# Altium schematic sheet USB.SchDoc: USB TO UART/PROGRAM
size A3
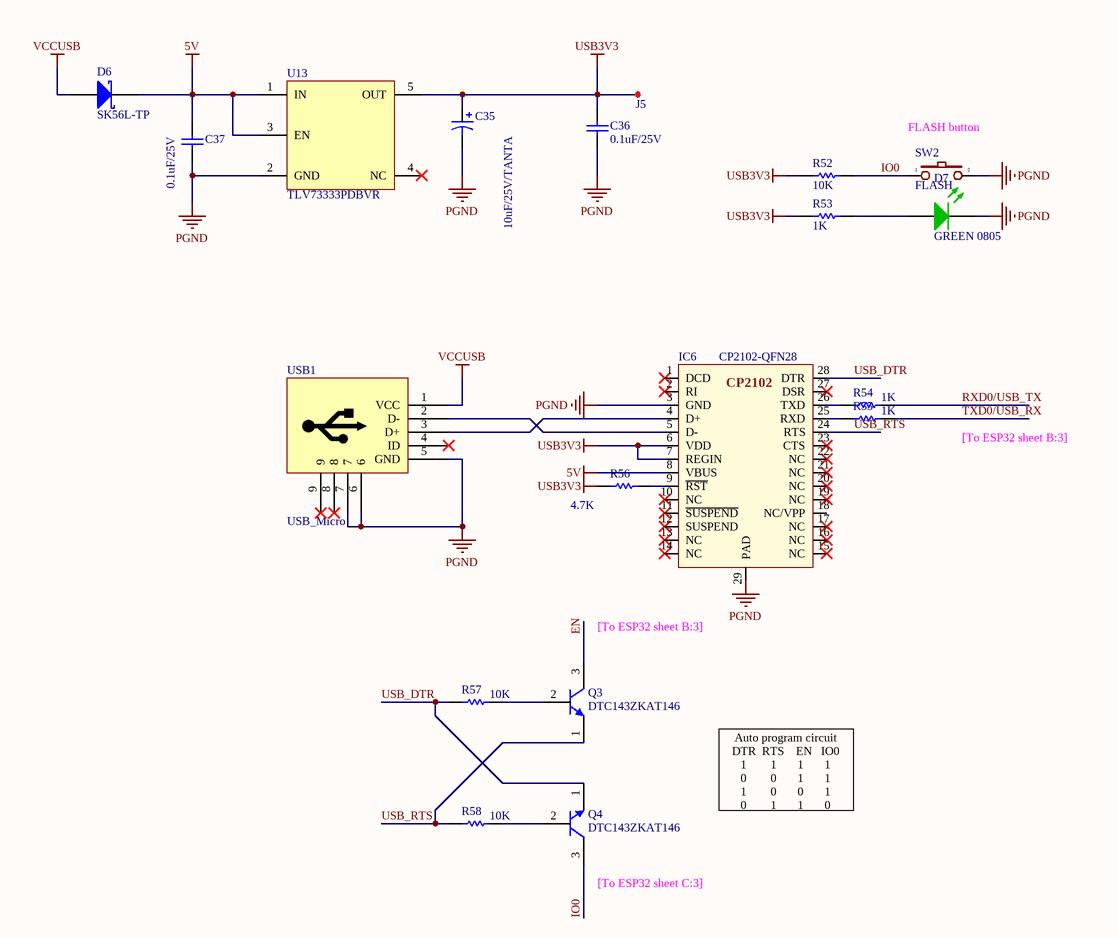
[diagram p0: USB.SchDoc]

## Parts
C35  10uF/25V/TANTA  [CAP TANT CASE B SMD]
C36  0.1uF/25V  [CAP_CERA_C2012(CC0805INCH)]
C37  0.1uF/25V  [CAP_CERA_C2012(CC0805INCH)]
D6  SK56L-TP  [30# SK56L-TPMSCT-ND]
D7  GREEN 0805  [Led 0805G]
IC6  CP2102-QFN28  [CP2102-QFN28]
J5  TEST POINT  [TEST POINT 1mm]  (value not drawn)
Q3  DTC143ZKAT146  [6# DTC143ZKAT146-E]
Q4  DTC143ZKAT146  [6# DTC143ZKAT146-E]
R52  10K  [Res 0805 SMD]
R53  1K  [Res 0805 SMD]
R54  1K  [Res 0805 SMD]
R55  1K  [Res 0805 SMD]
R56  4.7K  [Res 0805 SMD]
R57  10K  [Res 0805 SMD]
R58  10K  [Res 0805 SMD]
SW2  FLASH  [Button 3x4mm]
U13  TLV73333PDBVR  [20# TLV73333PDBVR - SOT23-65]
USB1  USB_Micro  [USB_MICRO_B - Digikey]

## Nets
5V: C37.2 D6.2(K) IC6.8(VBUS) U13.1(IN) U13.3(EN)
PGND: C35.2 C36.1 C37.1 D7.2(K) IC6.3(GND) IC6.29(PAD) SW2.2 U13.2(GND) USB1.5(GND) USB1.6 USB1.7
USB3V3: C35.1 C36.2 IC6.6(VDD) IC6.7(REGIN) J5.1(TP) R52.1 R53.1 R56.1 U13.5(OUT)
VCCUSB: D6.1(A) USB1.1(VCC)
EN: Q3.3(C)
IO0: Q4.3(C) R52.2 SW2.1
RXD0/USB_TX: R54.1
TXD0/USB_RX: R55.1
USB_DTR: IC6.28(DTR) Q4.1(E) R57.2
USB_RTS: IC6.24(RTS) Q3.1(E) R58.2
NetD7_1: D7.1(A) R53.2
NetIC6_4: IC6.4(D+) USB1.3(D+)
NetIC6_5: IC6.5(D-) USB1.2(D-)
NetIC6_9: IC6.9(~{RST}) R56.2
NetIC6_25: IC6.25(RXD) R55.2
NetIC6_26: IC6.26(TXD) R54.2
NetQ3_2: Q3.2(B) R57.1
NetQ4_2: Q4.2(B) R58.1

Not connected (* = marked no-connect by the designer): IC6 1(DCD)* 2(RI)* 10(NC)* 11(~{SUSPEND})* 12(SUSPEND)* 13(NC)* 14(NC)* 15(NC)* 16(NC)* 17(NC)* 18(NC/VPP) 19(NC)* 20(NC)* 21(NC)* 22(NC)* 23(CTS)* 27(DSR)*; U13 4(NC)*; USB1 4(ID)* 8* 9*

## Notes on the sheet
- (near SW2) FLASH button
- [To ESP32 sheet B:3]
- Auto program circuit
  DTR  RTS    EN   IO0
  1        1       1       1
  0        0       1       1
  1        0       0       1
  0        1       1       0
- (near Q4) [To ESP32 sheet C:3]
- Title
- Size:
- Date:
- A3
- Number:
- Time:
- Revision:
- Sheet
- of
- File:

## Library data of the parts
C35 = TAJB106M025RNJ: 10µF Molded Tantalum Capacitors 25V 1411 (3528 Metric) 3 Ohm; Manufacturer: KEMET; Digikey: 399-5125-1-ND
C36 = 0.1uF/50V/C0603/10%: 0.1µF ±10% 25V Ceramic Capacitor X7R 0805 (2012 Metric); Manufacturer: KEMET; ComponentLink1URL: http://www.murata.com/~/media/webrenewal/support/library/catalog/products/capacitor/mlcc/c02e.ashx; ComponentLink1Description: http://www.murata.com/~/media/webrenewal/support/library/catalog/products/capacitor/mlcc/c02e.ashx; Digikey: 478-3755-1-ND
C37 = 0.1uF/50V/C0603/10%: 0.1µF ±10% 25V Ceramic Capacitor X7R 0805 (2012 Metric); ComponentLink1URL: http://www.murata.com/~/media/webrenewal/support/library/catalog/products/capacitor/mlcc/c02e.ashx; ComponentLink1Description: http://www.murata.com/~/media/webrenewal/support/library/catalog/products/capacitor/mlcc/c02e.ashx; Digikey: 478-3755-1-ND
D6 = 30# SK56L-TP: DIODE SCHOTTKY 60V 5A DO214AB; ComponentLink1URL: http://www.mccsemi.com/up_pdf/SK52L-SK510L(DO-214AB).PDF; ComponentLink1Description: http://www.mccsemi.com/up_pdf/SK52L-SK510L(DO-214AB).PDF; Digikey: SK56L-TPMSCT-ND
D7 = LED GREEN 0603: Green 571nm LED Indication - Discrete 2V 0805 (2012 Metric); ComponentLink1URL: http://optoelectronics.liteon.com/upload/download/DS22-2000-074/S_110_LTST-C190KGKT.pdf; ComponentLink1Description: http://optoelectronics.liteon.com/upload/download/DS22-2000-074/S_110_LTST-C190KGKT.pdf; Digikey: 160-1426-1-ND
IC6 = CP2102: USB Bridge, USB to UART USB 2.0 UART Interface 28-QFN (5x5); Digikey: 336-3694-ND; VNBuy: https://banlinhkien.vn/goods-2607-cp2102-qfn28.html
J5 = PAD 1mm: TPoint
Q3 Q4 = 6#DTC143ZKAT146: Pre-Biased Bipolar Transistor (BJT) NPN - Pre-Biased 50V 100mA 250MHz 200mW Surface Mount SMT3; Digikey: DTC143ZKAT146CT-ND
R52 = 200K/R0603/1%: 10 kOhms ±1% 0.125W, 1/8W Chip Resistor 0805 (2012 Metric) Thick Film; Power (Watts): 0.1W, 1/10W; RoHS: RoHS Compliant; Category: Resistors; Part Status: Active; Features: Moisture Resistant; Operating Temperature: -55°C ~ 155°C; Package / Case: 0603 (1608 Metric); Supplier Device Package: 0603; Size / Dimension: 0.063" L x 0.031" W (1.60mm x 0.80mm); Height - Seated (Max): 0.022" (0.55mm); Failure Rate: -; ComponentLink1URL: http://www.yageo.com/documents/recent/PYu-RC_Group_51_RoHS_L_7.pdf; ComponentLink1Description: http://www.yageo.com/documents/recent/PYu-RC_Group_51_RoHS_L_7.pdf; Digikey: A126332CT-ND
R53 = 200K/R0603/1%: 1 kOhms ±1% 0.125W, 1/8W Chip Resistor 0805 (2012 Metric) Automotive AEC-Q200 Thick Film; Power (Watts): 0.1W, 1/10W; RoHS: RoHS Compliant; Category: Resistors; Part Status: Active; Features: Moisture Resistant; Operating Temperature: -55°C ~ 155°C; Package / Case: 0603 (1608 Metric); Supplier Device Package: 0603; Size / Dimension: 0.063" L x 0.031" W (1.60mm x 0.80mm); Height - Seated (Max): 0.022" (0.55mm); Failure Rate: -; ComponentLink1URL: http://www.yageo.com/documents/recent/PYu-RC_Group_51_RoHS_L_7.pdf; ComponentLink1Description: http://www.yageo.com/documents/recent/PYu-RC_Group_51_RoHS_L_7.pdf; Digikey: 541-1.00KCCT-ND
R54 R55 = 34.8K/R0805/1%: 1 kOhms ±1% 0.125W, 1/8W Chip Resistor 0805 (2012 Metric) Automotive AEC-Q200 Thick Film; Power Rating: 100mW; Resistance: 34.8kR; Voltage Rating: 50V; Case/Package: 0603; Case Code (Imperial): 0603; Case Code (Metric): 1608; Min Operating Temperature: -55°C; Max Operating Temperature: 155°C; Termination: SMD/SMT; Military Standard: Not; Voltage Rating (DC): 50V; Length: 1.6mm; Height: 0.45mm; Width: 0.8mm; Depth: 0.8mm; Lead Free: Lead Free; Digikey: 541-1.00KCCT-ND
R56 = 34.8K/R0805/1%: 4.7 kOhms ±1% 0.125W, 1/8W Chip Resistor 0805 (2012 Metric) Thick Film; Digikey: 541-4131-1-ND
R57 R58 = 34.8K/R0805/1%: 10 kOhms ±1% 0.125W, 1/8W Chip Resistor 0805 (2012 Metric) Thick Film; Power Rating: 100mW; Resistance: 34.8kR; Voltage Rating: 50V; Case/Package: 0603; Case Code (Imperial): 0603; Case Code (Metric): 1608; Min Operating Temperature: -55°C; Max Operating Temperature: 155°C; Termination: SMD/SMT; Military Standard: Not; Voltage Rating (DC): 50V; Length: 1.6mm; Height: 0.45mm; Width: 0.8mm; Depth: 0.8mm; Lead Free: Lead Free; Digikey: A126332CT-ND
SW2 = SW2: SWITCH TACTILE SPST-NO 0.05A 12V; Digikey: CKN10384CT-ND
U13 = 20#TLV73333PDBVR: Linear Voltage Regulator IC Positive Fixed 1 Output 3.3V 300mA SOT-23-5; Digikey: 296-40673-1-ND
USB1 = USB_MINI: USB - micro B USB 2.0 Receptacle Connector 5 Position Surface Mount, Right Angle; Through Hole; BuyVN: https://banlinhkien.vn/goods-5145-microusb-mk5p-dip.html; Digikey: 609-4618-1-ND